# Altium schematic sheet CH32L103F8P6-R0.SchDoc
size 304 x 254 mm
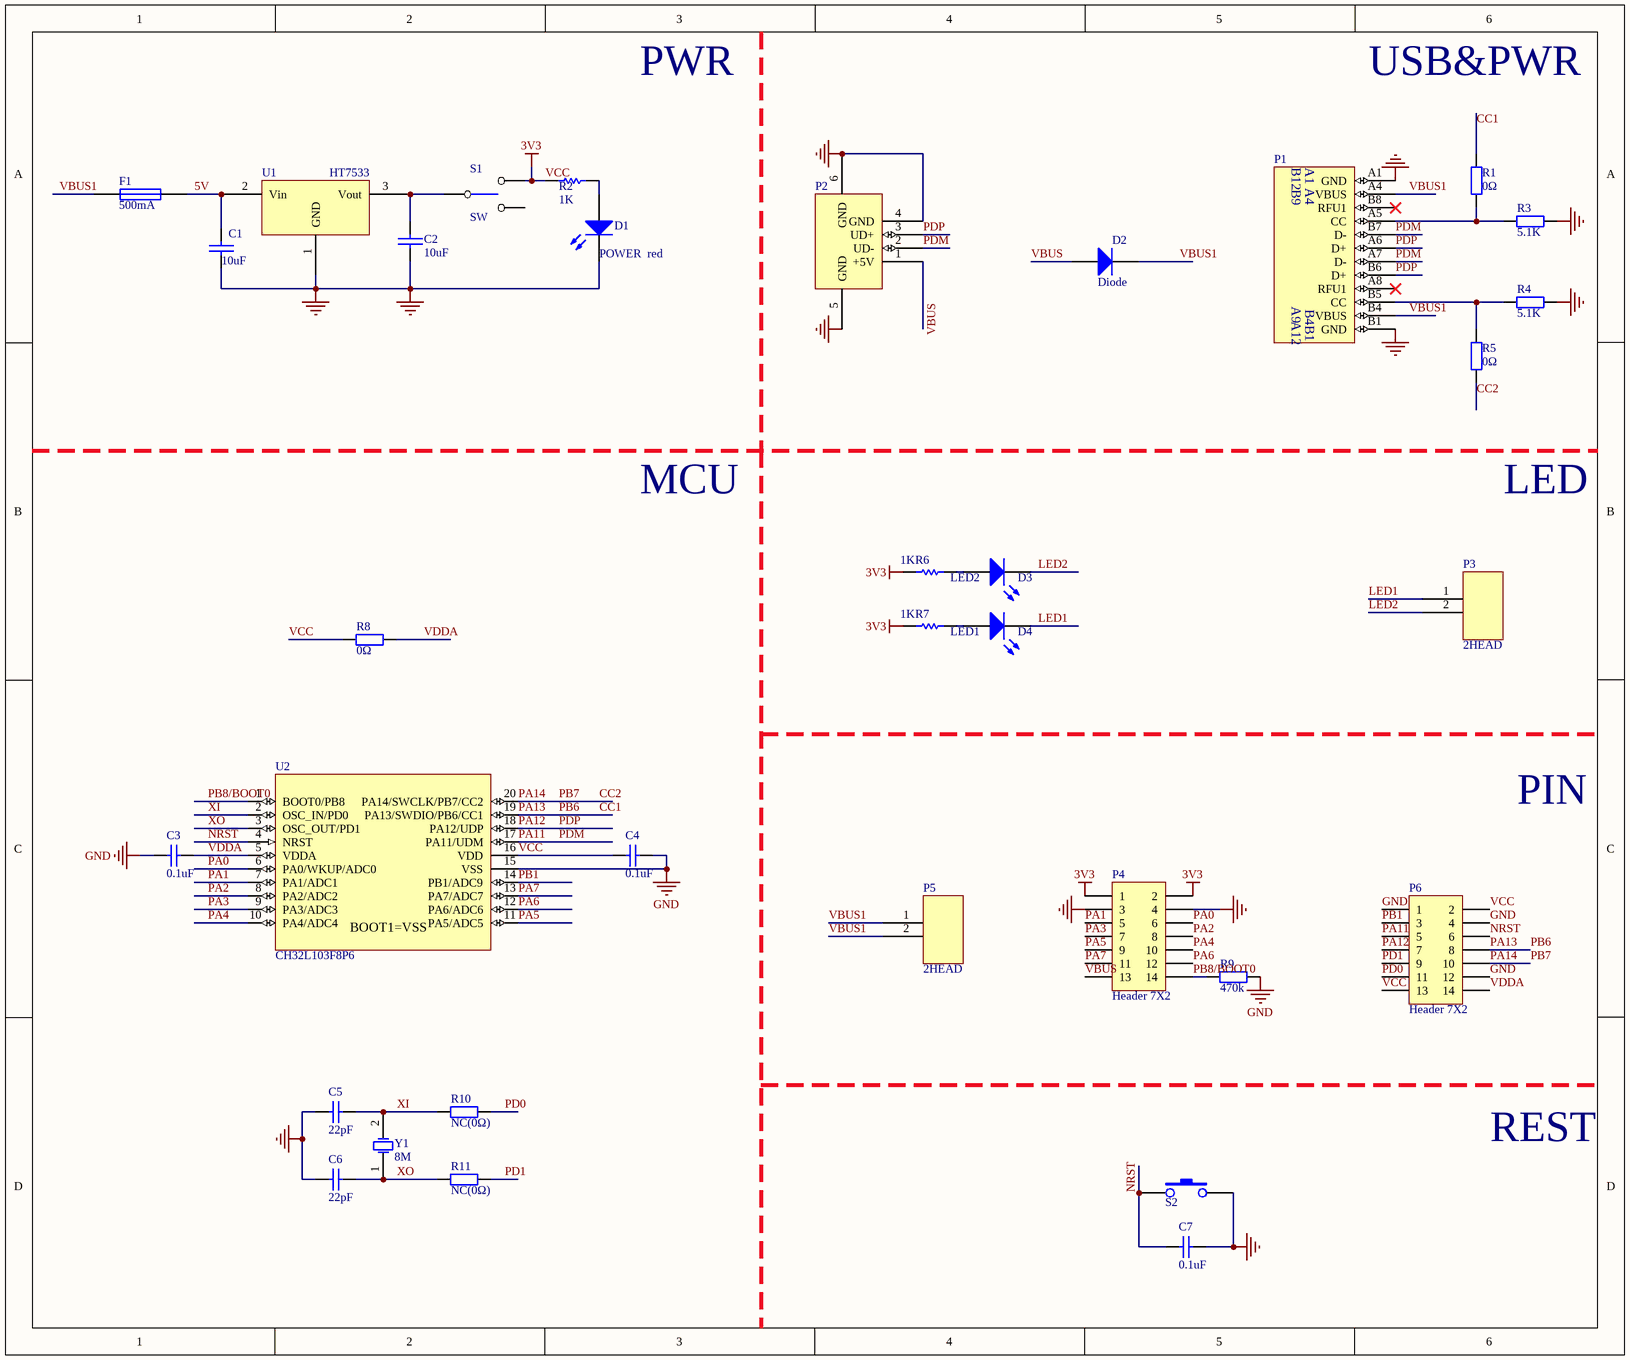
[diagram p0: CH32L103F8P6-R0.SchDoc]

## Parts
C1  10uF  [0603_C]
C2  10uF  [0603_C]
C3  0.1uF  [0603_C]
C4  0.1uF  [0603_C]
C5  22pF  [0603_C]
C6  22pF  [0603_C]
C7  0.1uF  [0603_C]
D1  POWER  red  [0603+]
D2  Diode  [SOD-123]
D3  LED2  [0603+]
D4  LED1  [0603+]
F1  500mA  [0603]
P1  TYPE-C  [TYPE-C-Receptacle-2.0]  (value not drawn)
P2  USB_A  [USBAF]  (value not drawn)
P3  2HEAD  [SIP2-2.54mm]
P4  Header 7X2  [IDC14-2.54mm]
P5  2HEAD  [SIP2-2.54mm]
P6  Header 7X2  [IDC14-2.54mm]
R1  0Ω  [0603]
R2  1K  [0603]
R3  5.1K  [0603]
R4  5.1K  [0603]
R5  0Ω  [0603]
R6  1K  [0603]
R7  1K  [0603]
R8  0Ω  [0603]
R9  470k  [0603]
R10  NC(0Ω)  [0603]
R11  NC(0Ω)  [0603]
S1  SW  [SW1]
S2  KEY  [贴片按键]  (value not drawn)
U1  HT7533  [SOT-89]
U2  CH32L103F8P6  [TSSOP20]
Y1  8M  [XT_AT49]

## Nets
GND: C1.2 C2.2 C3.2 C4.2 C5.1 C6.1 C7.1 D1.2(K) P1.A1(GND) P1.B1(GND) P2.4(GND) P2.5(GND) P2.6(GND) P4.3 P4.4 P6.1 P6.4 P6.12 R3.2 R4.2 R9.2 S2.3 U1.1(GND) U2.15(VSS)
VCC: C4.1 P4.1 P4.2 P6.2 P6.13 R2.2 R6.1 R7.1 R8.1 S1.3 U2.16(VDD)  [also labelled 3V3]
5V: C1.1 F1.2 U1.2(Vin)
CC1: P6.8 R1.2 U2.19(PA13/SWDIO/PB6/CC1)  [also labelled PA13, PB6]
CC2: P6.10 R5.1 U2.20(PA14/SWCLK/PB7/CC2)  [also labelled PA14, PB7]
LED1: D4.2(K) P3.1
LED2: D3.2(K) P3.2
NRST: C7.2 P6.6 S2.1 U2.4(NRST)
PA0: P4.6 U2.6(PA0/WKUP/ADC0)
PA1: P4.5 U2.7(PA1/ADC1)
PA2: P4.8 U2.8(PA2/ADC2)
PA3: P4.7 U2.9(PA3/ADC3)
PA4: P4.10 U2.10(PA4/ADC4)
PA5: P4.9 U2.11(PA5/ADC5)
PA6: P4.12 U2.12(PA6/ADC6)
PA7: P4.11 U2.13(PA7/ADC7)
PA11: P1.A7(D-) P1.B7(D-) P2.2(UD-) P6.5 U2.17(PA11/UDM)  [also labelled PDM]
PA12: P1.A6(D+) P1.B6(D+) P2.3(UD+) P6.7 U2.18(PA12/UDP)  [also labelled PDP]
PB1: P6.3 U2.14(PB1/ADC9)
PB8/BOOT0: P4.14 R9.1 U2.1(BOOT0/PB8)
PD0: P6.11 R10.1
PD1: P6.9 R11.1
VBUS: D2.1(A) P2.1(+5V) P4.13
VBUS1: D2.2(K) F1.1 P1.A4(VBUS) P1.B4(VBUS) P5.1 P5.2
VDDA: C3.1 P6.14 R8.2 U2.5(VDDA)
XI: C5.2 R10.2 U2.2(OSC_IN/PD0) Y1.2(OSC2)
XO: C6.2 R11.2 U2.3(OSC_OUT/PD1) Y1.1(OSC1)
NetC2_1: C2.1 S1.1 U1.3(Vout)
NetD1_1: D1.1(A) R2.1
NetD3_1: D3.1(A) R6.2
NetD4_1: D4.1(A) R7.2
NetP1_A5: P1.A5(CC) R1.1 R3.1
NetP1_B5: P1.B5(CC) R4.1 R5.2

Not connected (* = marked no-connect by the designer): P1 A8(RFU1)* B8(RFU1)*; S1 2

## Notes on the sheet
- PWR
- USB&PWR
- MCU
- LED
- PIN
- REST
- (in symbol CH32L103F8P6) BOOT1=VSS
- (in symbol TYPE-C1) B12; B9; A9; A12

## Library data of the parts
C1 C2 = CAP: Capacitor
C3 C4 = Cap: Capacitor; Value: 15pF; Published: 8-Jun-2000; LatestRevisionDate: 17-Jul-2002; LatestRevisionNote: Re-released for DXP Platform.; PackageReference: RAD-0.3; Publisher: Altium Limited
C5-C7 = Cap: Capacitor; Published: 8-Jun-2000; LatestRevisionDate: 17-Jul-2002; LatestRevisionNote: Re-released for DXP Platform.; PackageReference: RAD-0.3; Publisher: Altium Limited
  C7: Value: 0.1uF
D1 D3 D4 = LED0: Typical INFRARED GaAs LED; Published: 8-Jun-2000; LatestRevisionDate: 08-Jul-2005; LatestRevisionNote: Mech Layer 1 removed.; PackageReference: LED-0; Publisher: Altium Limited
D2 = Diode: Default Diode; Published: 8-Jun-2000; LatestRevisionDate: 17-Jul-2002; LatestRevisionNote: Re-released for DXP Platform.; PackageVersion: Sep-1996; PackageReference: SMC; Publisher: Altium Limited; Code_JEDEC: DO-214-AB
F1 = FUSE1: Fuse
P1 = TYPE-C1
P2 = USB: USB Port
P4 P6 = Header 7X2: Header, 7-Pin, Dual row; LatestRevisionDate: 17-Jul-2002; LatestRevisionNote: Re-released for DXP Platform.; Publisher: Altium Limited
R1 R3-R5 R8-R11 = Res2: Resistor
R2 R6 R7 = Res Semi: Semiconductor Resistor
U1 = 1117-3.3V
U2 = CH32L103F8P6: RISC-V LMD-MCU, 96MHz, USB, Type-C/PD, CAN, OPA, lower power
Y1 = XTAL: Crystal Oscillator; Published: 8-Jun-2000; LatestRevisionDate: 17-Jul-2002; LatestRevisionNote: Re-released for DXP Platform.; PackageReference: R38; Publisher: Altium Limited